# Altium schematic sheet sch(acdc, standart).SchDoc
size 420 x 297 mm; SheetNumber: 1; SheetTotal: 1
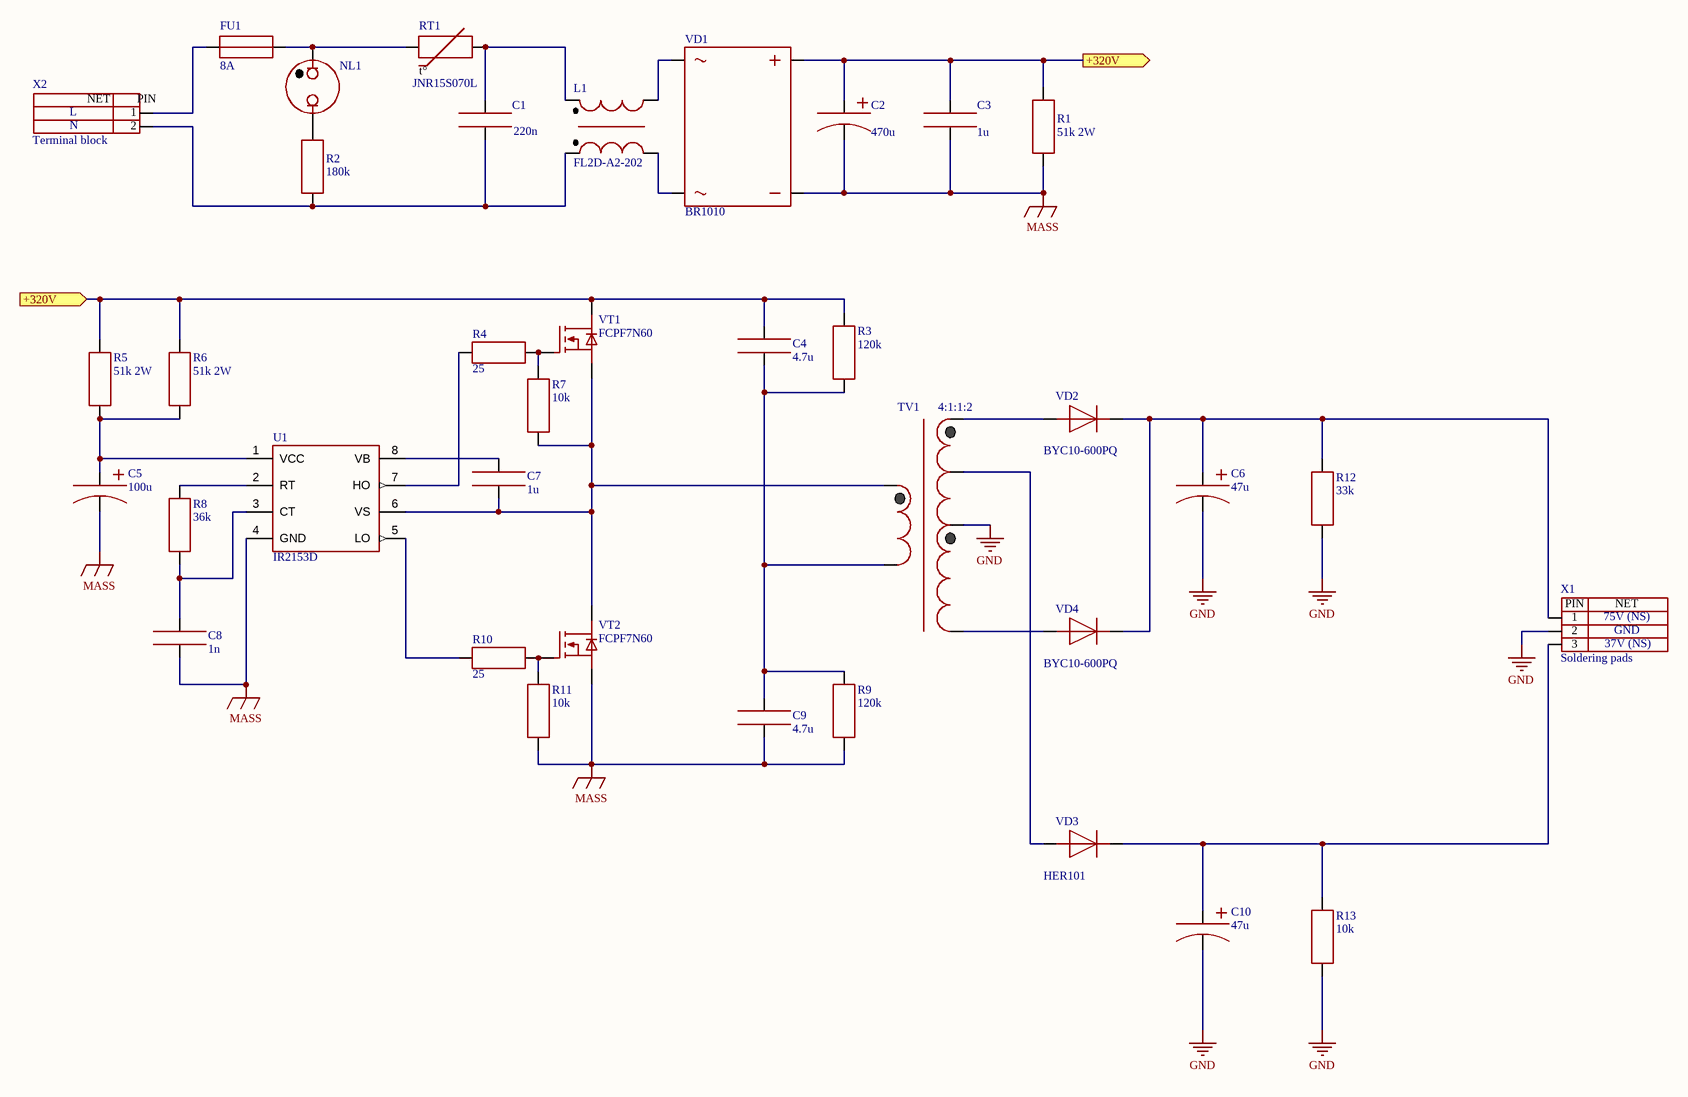
[diagram p0: sch(acdc, standart).SchDoc]

## Parts
C1  220n  [Конд_эмп P 15ММ]
C2  470u  [кондер ELEC D35.00mm S10.00mm H40.00mm]
C3  1u  [Конд_плен - P 20мм]
C4  4.7u  [конд металопленочный P 31мм]
C5  100u  [конд ELEC D6.30mm S2.50mm H11.00mm]
C6  47u  [конд ELEC D5.00mm S2.00mm H11.00mm]
C7  1u  [конд. кер. мн. слойные]
C8  1n  [конд. кер. мн. слойные]
C9  4.7u  [конд металопленочный P 31мм]
C10  47u  [конд ELEC D6.30mm S2.50mm H11.00mm]
FU1  8A  [предохранитель 20х5]
L1  FL2D-A2-202  [синфазный дросель FL2D-A2-202]
NL1  Lamp (Neon)  [2 PIN]  (value not drawn)
R1  51k 2W  [Res 2w]
R2  180k  [R1206]
R3  120k  [R1206]
R4  25  [R1206]
R5  51k 2W  [Res 2w]
R6  51k 2W  [Res 2w]
R7  10k  [R1206]
R8  36k  [R1206]
R9  120k  [R1206]
R10  25  [R1206]
R11  10k  [R1206]
R12  33k  [R1206]
R13  10k  [R1206]
RT1  JNR15S070L  [NTC 15мм (посадочное8мм)]
TV1  4:1:1:2  [Imp trans (2 wind, 2 sold)]
U1  IR2153D  [DIP 8]
VD1  BR1010  [BR_10(диодный мост)]
VD2  BYC10-600PQ  [TO-220-top(2 PIN DIODE)]
VD3  HER101  [DO-41]
VD4  BYC10-600PQ  [TO-220-top(2 PIN DIODE)]
VT1  FCPF7N60  [TO-220-top]
VT2  FCPF7N60  [TO-220-top]
X1  Soldering pads  [place 3]
X2  Terminal block  [5мм]

## Ports
+320V (in, see sch(acdc, standart)[3A]), +320V (out, see sch(acdc, standart)[1A])

## Nets
GND: C6.2 C10.2 R12.1 R13.1 TV1.5 X1.2(NET2)
MASS: C2.2 C3.1 C5.2 C8.1 C9.2 R1.1 R9.2 R11.1 U1.4(GND) VD1.3(-) VT2.3(Source)
+320V: C2.1 C3.2 C4.1 R1.2 R3.1 R5.2 R6.2 VD1.4(+) VT1.2(Drain) ; port +320V
NetC1_1: C1.1 L1.2 R2.1 X2.2(NET2)
NetC1_2: C1.2 L1.1 RT1.2
NetC4_2: C4.2 C9.1 R3.2 R9.1 TV1.2
NetC5_1: C5.1 R5.1 R6.1 U1.1(VCC)
NetC6_1: C6.1 R12.2 VD2.2(Cathode) VD4.2(Cathode) X1.1(NET1)
NetC7_1: C7.1 R7.1 TV1.1 U1.6(VS) VT1.3(Source) VT2.2(Drain)
NetC7_2: C7.2 U1.8(VB)
NetC8_2: C8.2 R8.1 U1.3(CT)
NetC10_1: C10.1 R13.2 VD3.2(Cathode) X1.3(NET3)
NetFU1_1: FU1.1 X2.1(NET1)
NetFU1_2: FU1.2 NL1.2 RT1.1
NetL1_3: L1.3 VD1.2
NetL1_4: L1.4 VD1.1
NetNL1_1: NL1.1 R2.2
NetR4_1: R4.1 U1.7(HO)
NetR4_2: R4.2 R7.2 VT1.1(Gate)
NetR8_2: R8.2 U1.2(RT)
NetR10_1: R10.1 U1.5(LO)
NetR10_2: R10.2 R11.2 VT2.1(Gate)
NetTV1_3: TV1.3 VD2.1(Anode)
NetTV1_4: TV1.4 VD3.1(Anode)
NetTV1_6: TV1.6 VD4.1(Anode)

## Notes on the sheet
- L
- N
- (near X1) 75V (NS)
- (near X1) GND
- (near X1) 37V (NS)
- THIS DOCUMENT AND THE DATA DISCLOSED HEREIN OR
- HEREWITH IS THE PROPERTY OF ALTIUM LIMITED AND MAY
- DWG NO:
- REVISION
- REV:
- DESCRIPTION
- DATE
- APPROVED
- BE FREELY DISTRIBUTED IN WHOLE. NO RIGHTS ARE
- RESERVED OR EXPRESS OR IMPLIED WARANTEE GIVEN.
- ENG:
- APPROVALS
- PROJECT
- DSN:
- CHK:
- REFERENCE DOCUMENTS
- PROJECT REVISION:
- TITLE
- DOCUMENT REVISION:
- DESIGN ITEM:
- BOM:
- FAB DWG:
- PCB DWG:
- ASSY DWG:
- SCALE:
- A3
- SIZE
- CAGE CODE
- FILE NAME
- DWG NO.
- SHEET
- OF
- REV
- (in symbol Terminal block (2-pin)) NET; PIN
- (in symbol Terminal block (3-pin)) PIN; NET
- (in symbol Thermistor) t°

## Library data of the parts
C1 C3 C7 C8 = Capacitor
C2 = Capacitor (Electrolytic)
C4 C9 = Capacitor: К73-17
C5 = Capacitor (Electrolytic): K50-35 25V
C6 = Capacitor (Electrolytic): К50-35 100V
C10 = Capacitor (Electrolytic): К50-35 50V
FU1 = Fuse
L1 = Common Choke: 2x2mH, 12A, 2x145mOhm
R1 = Resistor: 2W
R2-R13 = Resistor
RT1 = Thermistor
TV1 = Transformer (2 Windings, 2 Soldering)
U1 = IC_Driver_IR2153
VD1 = Diode Bridge (1 Phase)
VD2-VD4 = Diode
VT1 VT2 = Transistor (MOSFET, N, EMode)
X1 = Terminal block (3-pin)
X2 = Terminal block (2-pin)